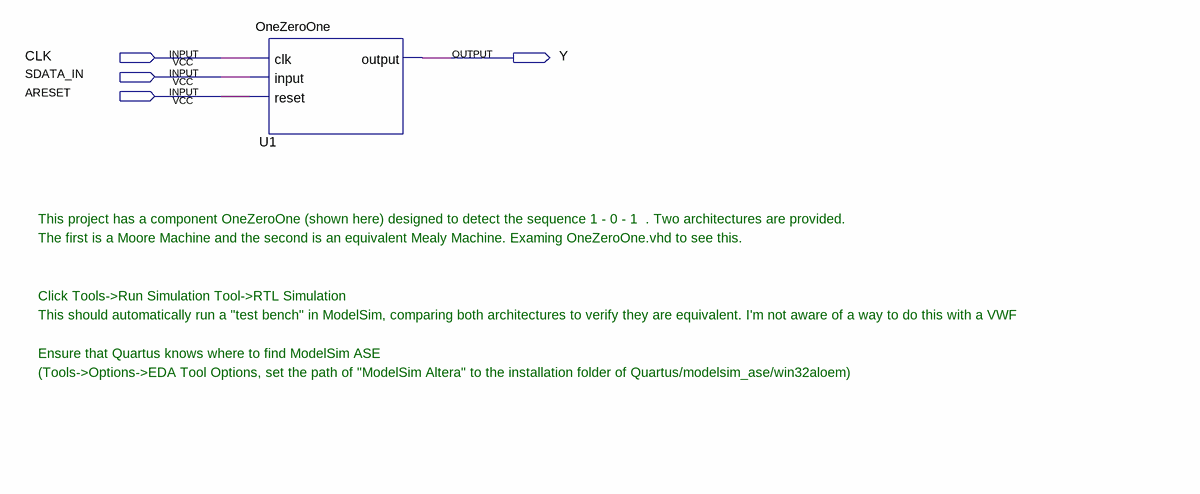
[diagram p0: schematic sheet]
// Quartus schematic top.bdf as structural Verilog: 1 symbols, 4 pins
module top (
  input  CLK,
  input  SDATA_IN,
  input  ARESET,
  output Y
);

  OneZeroOne U1 (.clk(CLK), .\input (SDATA_IN), .reset(ARESET), .\output (Y));

  // Notes on the sheet:
  //   This project has a component OneZeroOne (shown here) designed to detect the sequence 1 - 0 - 1  . Two architectures are provided. 
  //   The first is a Moore Machine and the second is an equivalent Mealy Machine. Examing OneZeroOne.vhd to see this.
  //   Click Tools->Run Simulation Tool->RTL Simulation 
  //   This should automatically run a "test bench" in ModelSim, comparing both architectures to verify they are equivalent. I'm not aware of a way to do this with a VWF
  //   Ensure that Quartus knows where to find ModelSim ASE
  //   (Tools->Options->EDA Tool Options, set the path of "ModelSim Altera" to the installation folder of Quartus/modelsim_ase/win32aloem)
endmodule
